# EasyEDA Pro project 学期项目.epro, schematic Schematic3

## Sheets
1 RGB_LED_2: Assembly Variant: Basic; Board Name: 灯板; Create Date: 2026-04-08; Page Name: P2; Project Name: 学期项目_2026-03-26_14-34-54_copy; Schematic Name: Schematic3; Update Date: 2026-04-08; BladeWidth: 10; Company: 嘉立创EDA; Page Size: A4; RegionStart: 1; ShowBorder: 1; TitleBlock: 1; TitleBlockPosition: 3; Version: V1.0; XRegionCount: 6; YRegionCount: 4
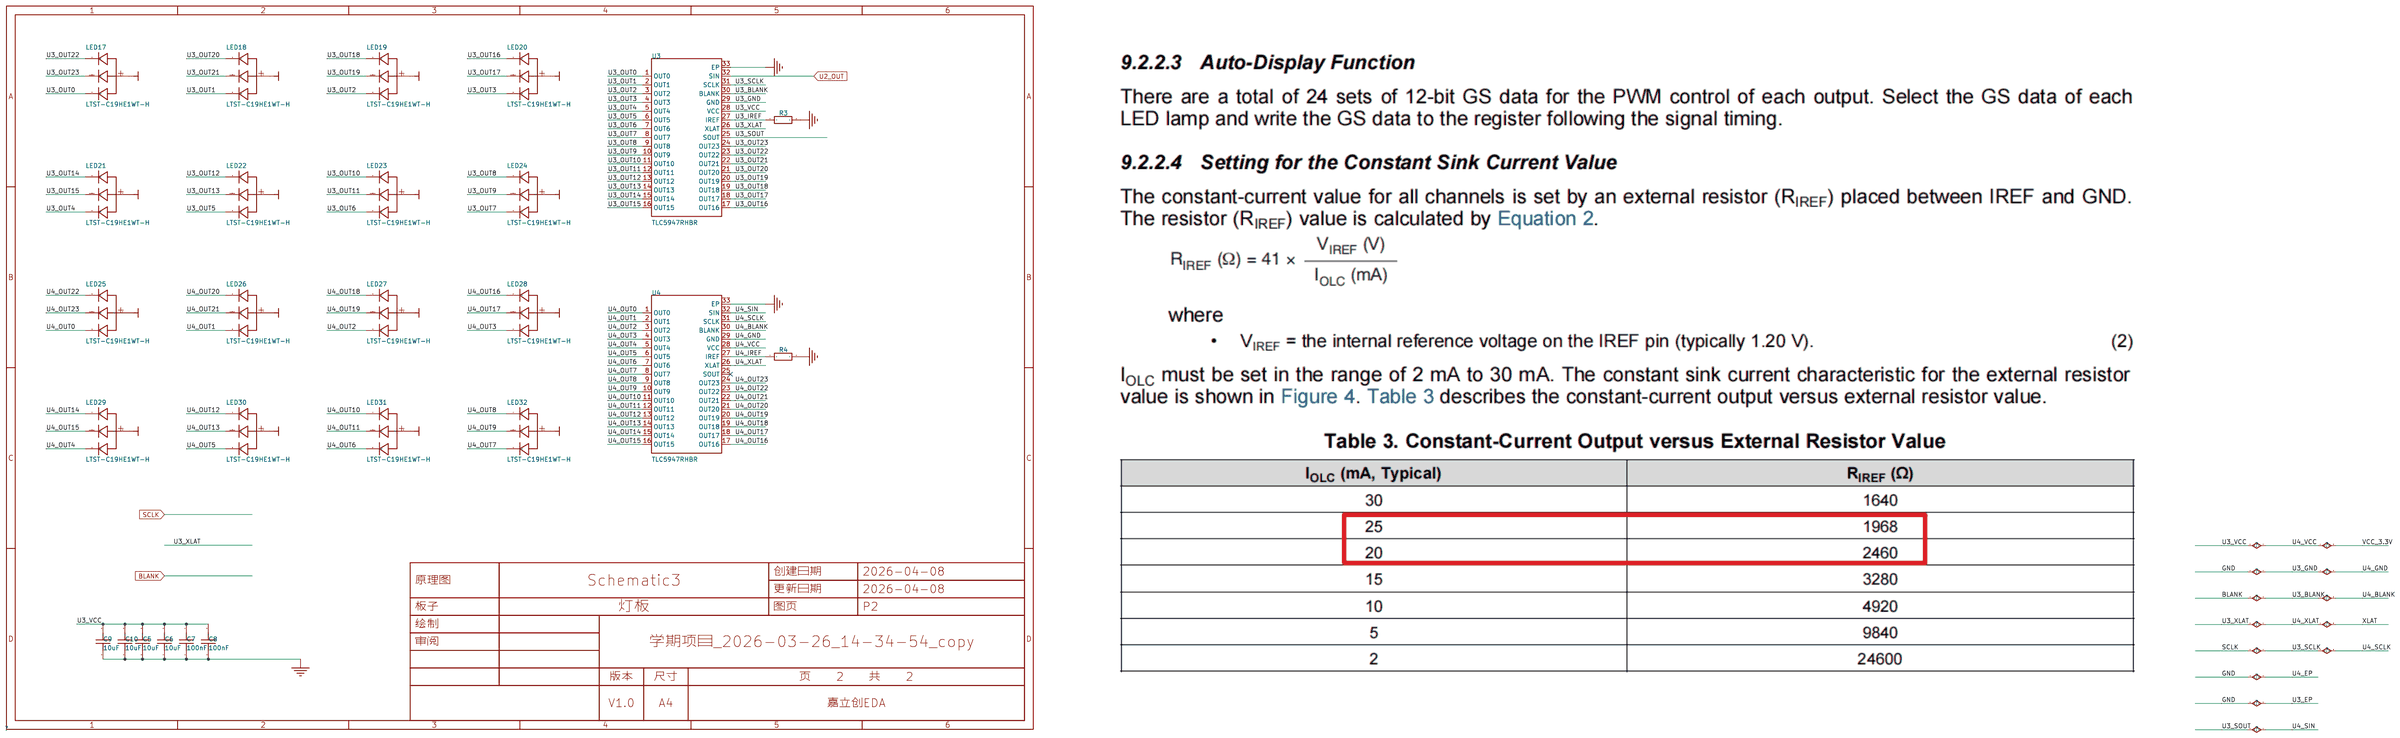
[diagram p0: RGB_LED_2]
2 RGB_LED
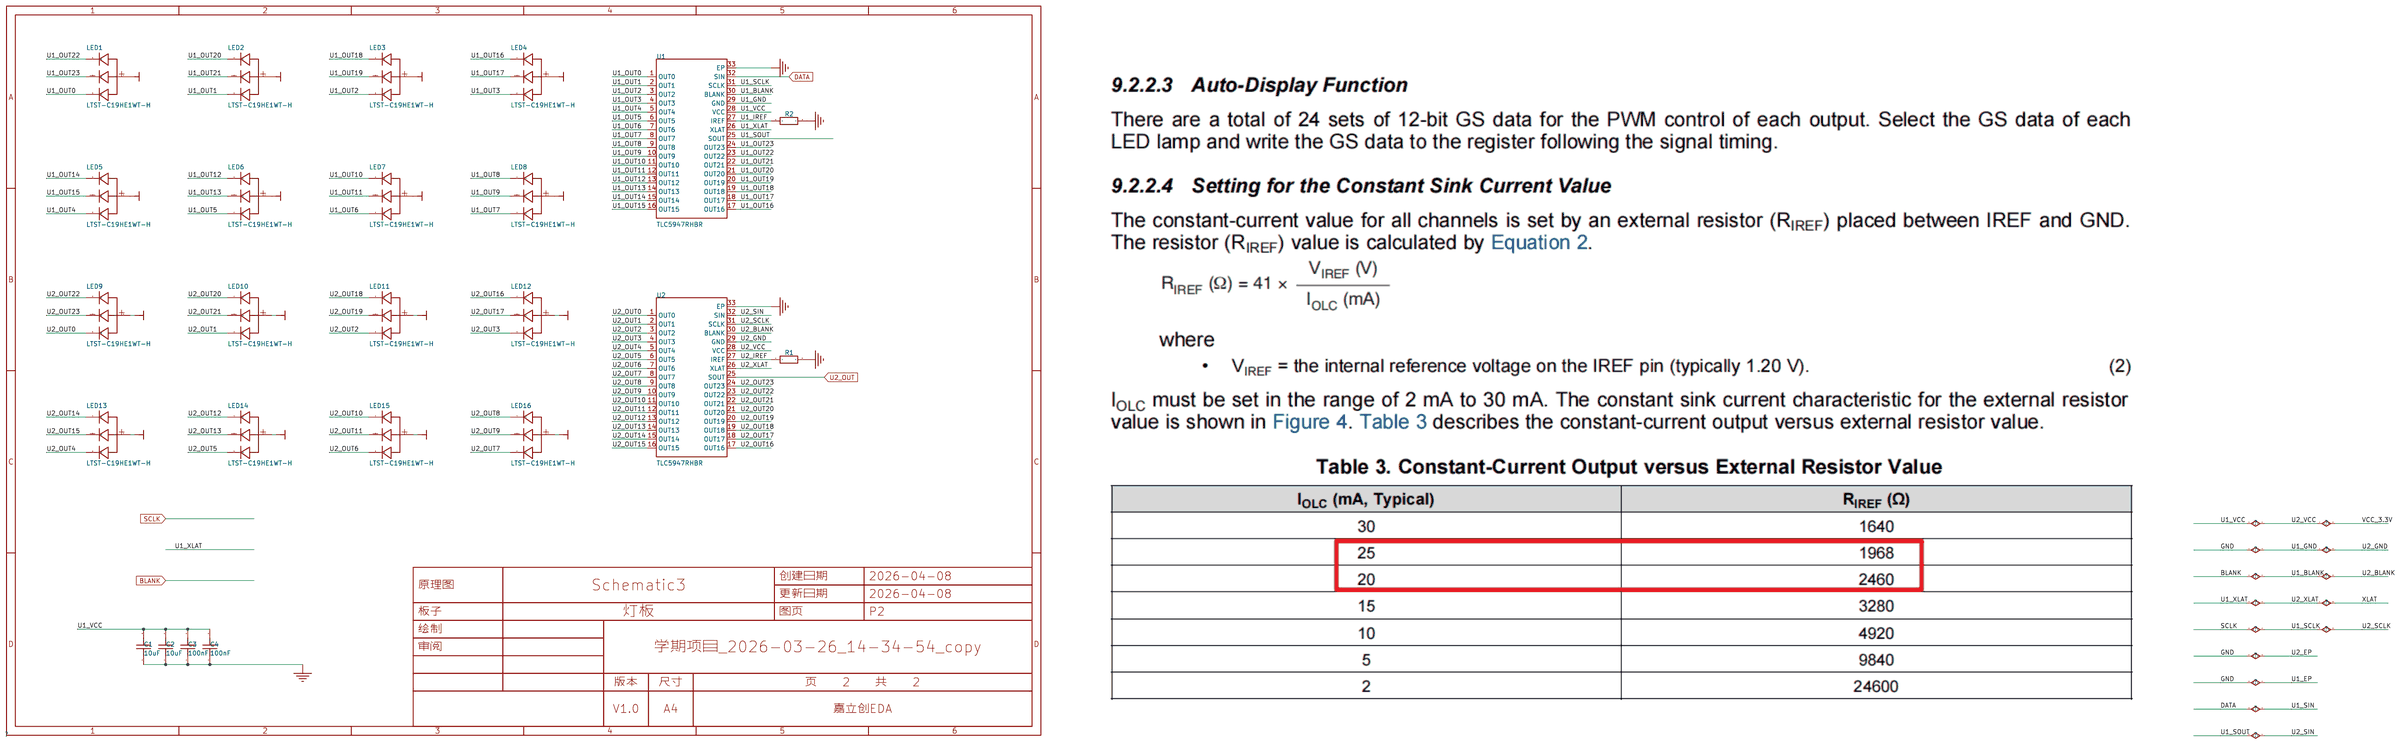
[diagram p1: RGB_LED]
3 P1: Board Name: Board3; Page Name: P1
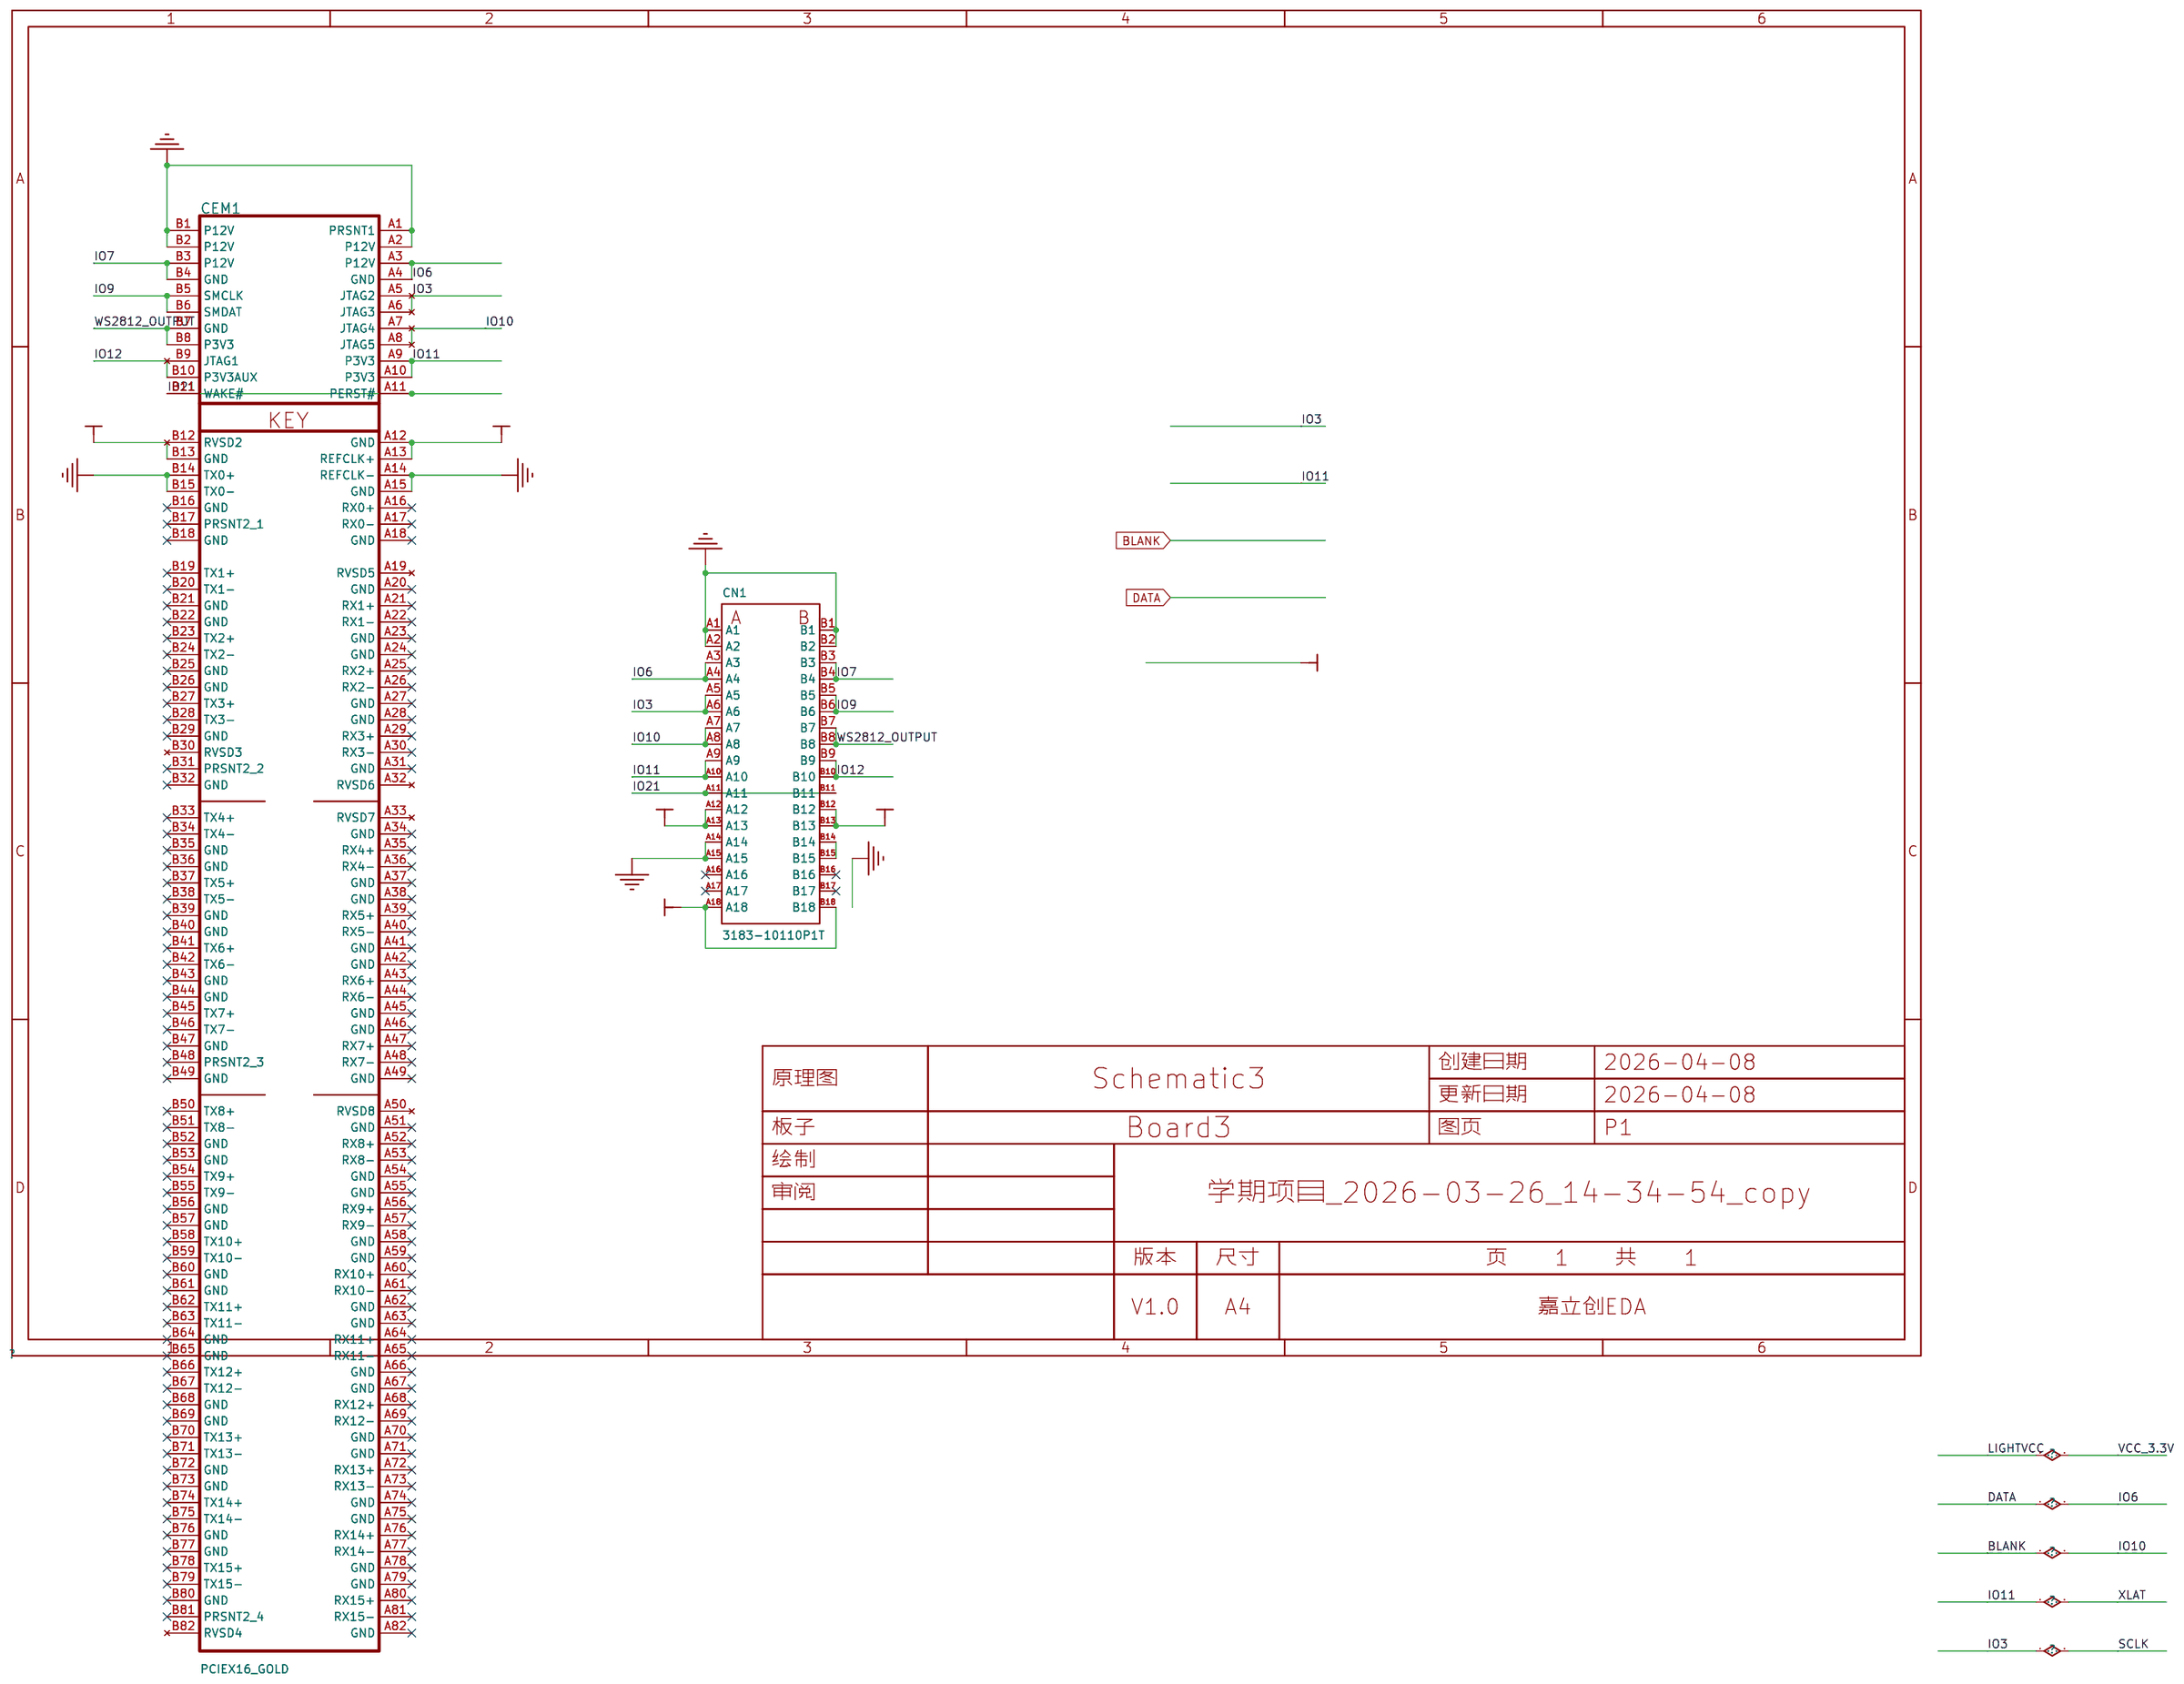
[diagram p2: P1]

## Parts
sheet P1
CEM1  PCIEX16_GOLD  [CEMFULLx16]
CN1  3183-10110P1T  [CONN-TH_36P-P1.00-V_3183-XXXXXPXT]  (no BOM)
sheet RGB_LED
C1  10uF  [C0603]
C2  10uF  [C0603]
C3  100nF  [C0603]
C4  100nF  [C0603]
LED1  LTST-C19HE1WT-H  [LED-ARRAY-SMD_0603-4P-L1.6-W1.6-BL-RD]
LED2  LTST-C19HE1WT-H  [LED-ARRAY-SMD_0603-4P-L1.6-W1.6-BL-RD]
LED3  LTST-C19HE1WT-H  [LED-ARRAY-SMD_0603-4P-L1.6-W1.6-BL-RD]
LED4  LTST-C19HE1WT-H  [LED-ARRAY-SMD_0603-4P-L1.6-W1.6-BL-RD]
LED5  LTST-C19HE1WT-H  [LED-ARRAY-SMD_0603-4P-L1.6-W1.6-BL-RD]
LED6  LTST-C19HE1WT-H  [LED-ARRAY-SMD_0603-4P-L1.6-W1.6-BL-RD]
LED7  LTST-C19HE1WT-H  [LED-ARRAY-SMD_0603-4P-L1.6-W1.6-BL-RD]
LED8  LTST-C19HE1WT-H  [LED-ARRAY-SMD_0603-4P-L1.6-W1.6-BL-RD]
LED9  LTST-C19HE1WT-H  [LED-ARRAY-SMD_0603-4P-L1.6-W1.6-BL-RD]
LED10  LTST-C19HE1WT-H  [LED-ARRAY-SMD_0603-4P-L1.6-W1.6-BL-RD]
LED11  LTST-C19HE1WT-H  [LED-ARRAY-SMD_0603-4P-L1.6-W1.6-BL-RD]
LED12  LTST-C19HE1WT-H  [LED-ARRAY-SMD_0603-4P-L1.6-W1.6-BL-RD]
LED13  LTST-C19HE1WT-H  [LED-ARRAY-SMD_0603-4P-L1.6-W1.6-BL-RD]
LED14  LTST-C19HE1WT-H  [LED-ARRAY-SMD_0603-4P-L1.6-W1.6-BL-RD]
LED15  LTST-C19HE1WT-H  [LED-ARRAY-SMD_0603-4P-L1.6-W1.6-BL-RD]
LED16  LTST-C19HE1WT-H  [LED-ARRAY-SMD_0603-4P-L1.6-W1.6-BL-RD]
R1  10K  [R0603]
R2  10K  [R0603]
U1  TLC5947RHBR  [VFQFN-32_L5.0-W5.0-P0.50-TL-EP3.5]
U2  TLC5947RHBR  [VFQFN-32_L5.0-W5.0-P0.50-TL-EP3.5]
sheet RGB_LED_2
C5  10uF  [C0603]
C6  10uF  [C0603]
C7  100nF  [C0603]
C8  100nF  [C0603]
C9  10uF  [C0603]
C10  10uF  [C0603]
LED17  LTST-C19HE1WT-H  [LED-ARRAY-SMD_0603-4P-L1.6-W1.6-BL-RD]
LED18  LTST-C19HE1WT-H  [LED-ARRAY-SMD_0603-4P-L1.6-W1.6-BL-RD]
LED19  LTST-C19HE1WT-H  [LED-ARRAY-SMD_0603-4P-L1.6-W1.6-BL-RD]
LED20  LTST-C19HE1WT-H  [LED-ARRAY-SMD_0603-4P-L1.6-W1.6-BL-RD]
LED21  LTST-C19HE1WT-H  [LED-ARRAY-SMD_0603-4P-L1.6-W1.6-BL-RD]
LED22  LTST-C19HE1WT-H  [LED-ARRAY-SMD_0603-4P-L1.6-W1.6-BL-RD]
LED23  LTST-C19HE1WT-H  [LED-ARRAY-SMD_0603-4P-L1.6-W1.6-BL-RD]
LED24  LTST-C19HE1WT-H  [LED-ARRAY-SMD_0603-4P-L1.6-W1.6-BL-RD]
LED25  LTST-C19HE1WT-H  [LED-ARRAY-SMD_0603-4P-L1.6-W1.6-BL-RD]
LED26  LTST-C19HE1WT-H  [LED-ARRAY-SMD_0603-4P-L1.6-W1.6-BL-RD]
LED27  LTST-C19HE1WT-H  [LED-ARRAY-SMD_0603-4P-L1.6-W1.6-BL-RD]
LED28  LTST-C19HE1WT-H  [LED-ARRAY-SMD_0603-4P-L1.6-W1.6-BL-RD]
LED29  LTST-C19HE1WT-H  [LED-ARRAY-SMD_0603-4P-L1.6-W1.6-BL-RD]
LED30  LTST-C19HE1WT-H  [LED-ARRAY-SMD_0603-4P-L1.6-W1.6-BL-RD]
LED31  LTST-C19HE1WT-H  [LED-ARRAY-SMD_0603-4P-L1.6-W1.6-BL-RD]
LED32  LTST-C19HE1WT-H  [LED-ARRAY-SMD_0603-4P-L1.6-W1.6-BL-RD]
R3  10K  [R0603]
R4  10K  [R0603]
U3  TLC5947RHBR  [VFQFN-32_L5.0-W5.0-P0.50-TL-EP3.5]
U4  TLC5947RHBR  [VFQFN-32_L5.0-W5.0-P0.50-TL-EP3.5]

## Library data of the parts
CEM1 = CEMFULL
CN1 = 3183-10110P1T: PCIE3.0 DIP连接器 带双定位柱 卡边缘插槽; LCSC Part Name: 黑色 PCIE3.0 DIP连接器 带双定位柱 卡边缘插槽; Supplier Part: C404109; Manufacturer: UMaxconn(友贸); Supplier Footprint: 插件,P=1mm; JLCPCB Part Class: Extended Part; Datasheet: https://item.szlcsc.com/datasheet/3183-10110P1T/391111.html; Supplier: LCSC; Number of Pins: 36P; Number of Data Pins: 142P; Mounting Type: 直插; Versions: PCI-E 3.0; Height Above Board: 11.25mm; Supplementary Features: 带柱; Operating Temperature: -40℃~+85℃
C1-C10 = CC0603MRX7R9BB104: 容值:100nF;精度:±20%;额定电压:50V;温度系数:X7R;; LCSC Part Name: 100nF ±20% 50V; Supplier Part: C2175984; Manufacturer: YAGEO(国巨); Supplier Footprint: 0603; JLCPCB Part Class: Extended Part; Datasheet: https://item.szlcsc.com/datasheet/CC0603MRX7R9BB104/2268050.html; Supplier: LCSC; Tolerance: ±20%; Voltage Rating: 50V; Temperature Coefficient: X7R
LED1-LED32 = LTST-C19HE1WT-H: 特性：符合ROHS标准，为绿色产品。 超薄（0.35mm）全彩贴片式芯片LED。 采用7英寸直径卷轴上的8mm胶带封装。 EIA标准封装。 与IC兼容。 与自动贴装设备兼容。 与红外和气相回流焊工艺兼容; LCSC Part Name: RGB三色; Supplier Part: C427425; Manufacturer: LITEON(光宝); Supplier Footprint: SMD-4P,1.6x1.6mm; JLCPCB Part Class: Extended Part; Datasheet: https://item.szlcsc.com/datasheet/LTST-C19HE1WT-H/421645.html; Supplier: LCSC; Diode Configuration: 共阳极; Wavelength - Dominant: B:470nm；R:624nm；G:525nm; Peak Wavelength: G:520nm；R:632nm；B:468nm; Luminous Intensity: R:85mcd~240mcd；G:160mcd~280mcd；B:28mcd~180mcd; Viewing Angle: 130°; Lens Color: 白色雾状透镜; Forward Current: R:20mA；B:20mA；G:20mA; Forward Voltage(Vf): R:1.8V~2.4V；B:2.8V~3.9V；G:2.8V~3.9V; Power(Watts): B:80mW；G:80mW；R:75mW; Operating Temperature: -20℃~+80℃; Length: 1.6mm; Width: 1.6mm; Height: 0.35mm
R1-R4 = Res_0603: Supplier Footprint: 0603
U1-U4 = TLC5947RHBR: 开关频率:30MHz;通道数:24;调光:PWM;拓扑结构:-;; Supplier Part: C702083; Manufacturer: TI(德州仪器); Supplier Footprint: VFQFN-32-EP(5x5); JLCPCB Part Class: Extended Part; Datasheet: https://www.ti.com/cn/lit/gpn/tlc5947; Supplier: LCSC; Frequency - Switching: 30MHz; Number of Channels: 24; Dimming: PWM; Operating temperature: -40℃~+85℃

## Nets
GND: C1.1 C2.1 C3.1 C4.1 C5.1 C6.1 C7.1 C8.1 C9.1 C10.1 CEM1.A1(PRSNT1) CEM1.A2(P12V) CEM1.A14(REFCLK-) CEM1.A15(GND) CEM1.B1(P12V) CEM1.B2(P12V) CEM1.B14(TX0+) CEM1.B15(TX0-) CN1.A1 CN1.A2 CN1.A14 CN1.A15 CN1.B1 CN1.B2 R1.2 R2.2 R3.2 R4.2 U1.29(GND) U1.33(EP) U2.29(GND) U2.33(EP) U3.29(GND) U3.33(EP) U4.29(GND) U4.33(EP)
PVCC: CN1.A18 CN1.B18
BLANK: CEM1.A7(JTAG4) CEM1.A8(JTAG5) CN1.A7 CN1.A8 U1.30(BLANK) U2.30(BLANK) U3.30(BLANK) U4.30(BLANK)
DATA: CEM1.A3(P12V) CEM1.A4(GND) CN1.A3 CN1.A4 U1.32(SIN)
IO3: CEM1.A5(JTAG2) CEM1.A6(JTAG3) CN1.A5 CN1.A6 U1.31(SCLK) U2.31(SCLK) U3.31(SCLK) U4.31(SCLK)
IO7: CEM1.B3(P12V) CEM1.B4(GND) CN1.B3 CN1.B4
IO9: CEM1.B5(SMCLK) CEM1.B6(SMDAT) CN1.B5 CN1.B6
IO11: CEM1.A9(P3V3) CEM1.A10(P3V3) CN1.A9 CN1.A10 U1.26(XLAT) U2.26(XLAT) U3.26(XLAT) U4.26(XLAT)
IO12: CEM1.B9(JTAG1) CEM1.B10(P3V3AUX) CN1.B9 CN1.B10
IO21: CEM1.A11(PERST#) CEM1.B11(WAKE#) CN1.A11 CN1.B11
LIGHTVCC: C1.2 C2.2 C3.2 C4.2 C5.2 C6.2 C7.2 C8.2 C9.2 C10.2 CEM1.A12(GND) CEM1.A13(REFCLK+) CEM1.B12(RVSD2) CEM1.B13(GND) CN1.A12 CN1.A13 CN1.B12 CN1.B13 LED1.4(A) LED2.4(A) LED3.4(A) LED4.4(A) LED5.4(A) LED6.4(A) LED7.4(A) LED8.4(A) LED9.4(A) LED10.4(A) LED11.4(A) LED12.4(A) LED13.4(A) LED14.4(A) LED15.4(A) LED16.4(A) LED17.4(A) LED18.4(A) LED19.4(A) LED20.4(A) LED21.4(A) LED22.4(A) LED23.4(A) LED24.4(A) LED25.4(A) LED26.4(A) LED27.4(A) LED28.4(A) LED29.4(A) LED30.4(A) LED31.4(A) LED32.4(A) U1.28(VCC) U2.28(VCC) U3.28(VCC) U4.28(VCC)
U1_IREF: R2.1 U1.27(IREF)
U1_OUT0: LED1.3(C3) U1.1(OUT0)
U1_OUT1: LED2.3(C3) U1.2(OUT1)
U1_OUT2: LED3.3(C3) U1.3(OUT2)
U1_OUT3: LED4.3(C3) U1.4(OUT3)
U1_OUT4: LED5.3(C3) U1.5(OUT4)
U1_OUT5: LED6.3(C3) U1.6(OUT5)
U1_OUT6: LED7.3(C3) U1.7(OUT6)
U1_OUT7: LED8.3(C3) U1.8(OUT7)
U1_OUT8: LED8.1(C1) U1.9(OUT8)
U1_OUT9: LED8.2(C2) U1.10(OUT9)
U1_OUT10: LED7.1(C1) U1.11(OUT10)
U1_OUT11: LED7.2(C2) U1.12(OUT11)
U1_OUT12: LED6.1(C1) U1.13(OUT12)
U1_OUT13: LED6.2(C2) U1.14(OUT13)
U1_OUT14: LED5.1(C1) U1.15(OUT14)
U1_OUT15: LED5.2(C2) U1.16(OUT15)
U1_OUT16: LED4.1(C1) U1.17(OUT16)
U1_OUT17: LED4.2(C2) U1.18(OUT17)
U1_OUT18: LED3.1(C1) U1.19(OUT18)
U1_OUT19: LED3.2(C2) U1.20(OUT19)
U1_OUT20: LED2.1(C1) U1.21(OUT20)
U1_OUT21: LED2.2(C2) U1.22(OUT21)
U1_OUT22: LED1.1(C1) U1.23(OUT22)
U1_OUT23: LED1.2(C2) U1.24(OUT23)
U1_SOUT: U1.25(SOUT) U2.32(SIN)
U2_IREF: R1.1 U2.27(IREF)
U2_OUT: U2.25(SOUT) U3.32(SIN)
U2_OUT0: LED9.3(C3) U2.1(OUT0)
U2_OUT1: LED10.3(C3) U2.2(OUT1)
U2_OUT2: LED11.3(C3) U2.3(OUT2)
U2_OUT3: LED12.3(C3) U2.4(OUT3)
U2_OUT4: LED13.3(C3) U2.5(OUT4)
U2_OUT5: LED14.3(C3) U2.6(OUT5)
U2_OUT6: LED15.3(C3) U2.7(OUT6)
U2_OUT7: LED16.3(C3) U2.8(OUT7)
U2_OUT8: LED16.1(C1) U2.9(OUT8)
U2_OUT9: LED16.2(C2) U2.10(OUT9)
U2_OUT10: LED15.1(C1) U2.11(OUT10)
U2_OUT11: LED15.2(C2) U2.12(OUT11)
U2_OUT12: LED14.1(C1) U2.13(OUT12)
U2_OUT13: LED14.2(C2) U2.14(OUT13)
U2_OUT14: LED13.1(C1) U2.15(OUT14)
U2_OUT15: LED13.2(C2) U2.16(OUT15)
U2_OUT16: LED12.1(C1) U2.17(OUT16)
U2_OUT17: LED12.2(C2) U2.18(OUT17)
U2_OUT18: LED11.1(C1) U2.19(OUT18)
U2_OUT19: LED11.2(C2) U2.20(OUT19)
U2_OUT20: LED10.1(C1) U2.21(OUT20)
U2_OUT21: LED10.2(C2) U2.22(OUT21)
U2_OUT22: LED9.1(C1) U2.23(OUT22)
U2_OUT23: LED9.2(C2) U2.24(OUT23)
U3_IREF: R3.1 U3.27(IREF)
U3_OUT0: LED17.3(C3) U3.1(OUT0)
U3_OUT1: LED18.3(C3) U3.2(OUT1)
U3_OUT2: LED19.3(C3) U3.3(OUT2)
U3_OUT3: LED20.3(C3) U3.4(OUT3)
U3_OUT4: LED21.3(C3) U3.5(OUT4)
U3_OUT5: LED22.3(C3) U3.6(OUT5)
U3_OUT6: LED23.3(C3) U3.7(OUT6)
U3_OUT7: LED24.3(C3) U3.8(OUT7)
U3_OUT8: LED24.1(C1) U3.9(OUT8)
U3_OUT9: LED24.2(C2) U3.10(OUT9)
U3_OUT10: LED23.1(C1) U3.11(OUT10)
U3_OUT11: LED23.2(C2) U3.12(OUT11)
U3_OUT12: LED22.1(C1) U3.13(OUT12)
U3_OUT13: LED22.2(C2) U3.14(OUT13)
U3_OUT14: LED21.1(C1) U3.15(OUT14)
U3_OUT15: LED21.2(C2) U3.16(OUT15)
U3_OUT16: LED20.1(C1) U3.17(OUT16)
U3_OUT17: LED20.2(C2) U3.18(OUT17)
U3_OUT18: LED19.1(C1) U3.19(OUT18)
U3_OUT19: LED19.2(C2) U3.20(OUT19)
U3_OUT20: LED18.1(C1) U3.21(OUT20)
U3_OUT21: LED18.2(C2) U3.22(OUT21)
U3_OUT22: LED17.1(C1) U3.23(OUT22)
U3_OUT23: LED17.2(C2) U3.24(OUT23)
U3_SOUT: U3.25(SOUT) U4.32(SIN)
U4_IREF: R4.1 U4.27(IREF)
U4_OUT0: LED25.3(C3) U4.1(OUT0)
U4_OUT1: LED26.3(C3) U4.2(OUT1)
U4_OUT2: LED27.3(C3) U4.3(OUT2)
U4_OUT3: LED28.3(C3) U4.4(OUT3)
U4_OUT4: LED29.3(C3) U4.5(OUT4)
U4_OUT5: LED30.3(C3) U4.6(OUT5)
U4_OUT6: LED31.3(C3) U4.7(OUT6)
U4_OUT7: LED32.3(C3) U4.8(OUT7)
U4_OUT8: LED32.1(C1) U4.9(OUT8)
U4_OUT9: LED32.2(C2) U4.10(OUT9)
U4_OUT10: LED31.1(C1) U4.11(OUT10)
U4_OUT11: LED31.2(C2) U4.12(OUT11)
U4_OUT12: LED30.1(C1) U4.13(OUT12)
U4_OUT13: LED30.2(C2) U4.14(OUT13)
U4_OUT14: LED29.1(C1) U4.15(OUT14)
U4_OUT15: LED29.2(C2) U4.16(OUT15)
U4_OUT16: LED28.1(C1) U4.17(OUT16)
U4_OUT17: LED28.2(C2) U4.18(OUT17)
U4_OUT18: LED27.1(C1) U4.19(OUT18)
U4_OUT19: LED27.2(C2) U4.20(OUT19)
U4_OUT20: LED26.1(C1) U4.21(OUT20)
U4_OUT21: LED26.2(C2) U4.22(OUT21)
U4_OUT22: LED25.1(C1) U4.23(OUT22)
U4_OUT23: LED25.2(C2) U4.24(OUT23)
WS2812_OUTPUT: CEM1.B7(GND) CEM1.B8(P3V3) CN1.B7 CN1.B8
Net-(CN1-B14): CN1.B14 CN1.B15

Not connected (* = marked no-connect by the designer): CEM1 A16(RX0+)* A17(RX0-)* A18(GND)* A19(RVSD5) A20(GND)* A21(RX1+)* A22(RX1-)* A23(GND)* A24(GND)* A25(RX2+)* A26(RX2-)* A27(GND)* A28(GND)* A29(RX3+)* A30(RX3-)* A31(GND)* A32(RVSD6) A33(RVSD7) A34(GND)* A35(RX4+)* A36(RX4-)* A37(GND)* A38(GND)* A39(RX5+)* A40(RX5-)* A41(GND)* A42(GND)* A43(RX6+)* A44(RX6-)* A45(GND)* A46(GND)* A47(RX7+)* A48(RX7-)* A49(GND)* A50(RVSD8) A51(GND)* A52(RX8+)* A53(RX8-)* A54(GND)* A55(GND)* A56(RX9+)* A57(RX9-)* A58(GND)* A59(GND)* A60(RX10+)* A61(RX10-)* A62(GND)* A63(GND)* A64(RX11+)* A65(RX11-)* A66(GND)* A67(GND)* A68(RX12+)* A69(RX12-)* A70(GND)* A71(GND)* A72(RX13+)* A73(RX13-)* A74(GND)* A75(GND)* A76(RX14+)* A77(RX14-)* A78(GND)* A79(GND)* A80(RX15+)* A81(RX15-)* A82(GND)* B16(GND)* B17(PRSNT2_1)* B18(GND)* B19(TX1+)* B20(TX1-)* B21(GND)* B22(GND)* B23(TX2+)* B24(TX2-)* B25(GND)* B26(GND)* B27(TX3+)* B28(TX3-)* B29(GND)* B30(RVSD3) B31(PRSNT2_2)* B32(GND)* B33(TX4+)* B34(TX4-)* B35(GND)* B36(GND)* B37(TX5+)* B38(TX5-)* B39(GND)* B40(GND)* B41(TX6+)* B42(TX6-)* B43(GND)* B44(GND)* B45(TX7+)* B46(TX7-)* B47(GND)* B48(PRSNT2_3)* B49(GND)* B50(TX8+)* B51(TX8-)* B52(GND)* B53(GND)* B54(TX9+)* B55(TX9-)* B56(GND)* B57(GND)* B58(TX10+)* B59(TX10-)* B60(GND)* B61(GND)* B62(TX11+)* B63(TX11-)* B64(GND)* B65(GND)* B66(TX12+)* B67(TX12-)* B68(GND)* B69(GND)* B70(TX13+)* B71(TX13-)* B72(GND)* B73(GND)* B74(TX14+)* B75(TX14-)* B76(GND)* B77(GND)* B78(TX15+)* B79(TX15-)* B80(GND)* B81(PRSNT2_4)* B82(RVSD4); CN1 A16* A17* B16* B17*; U4 25(SOUT)*
